# Altium project dac_brd_raton_v0.PrjPcb
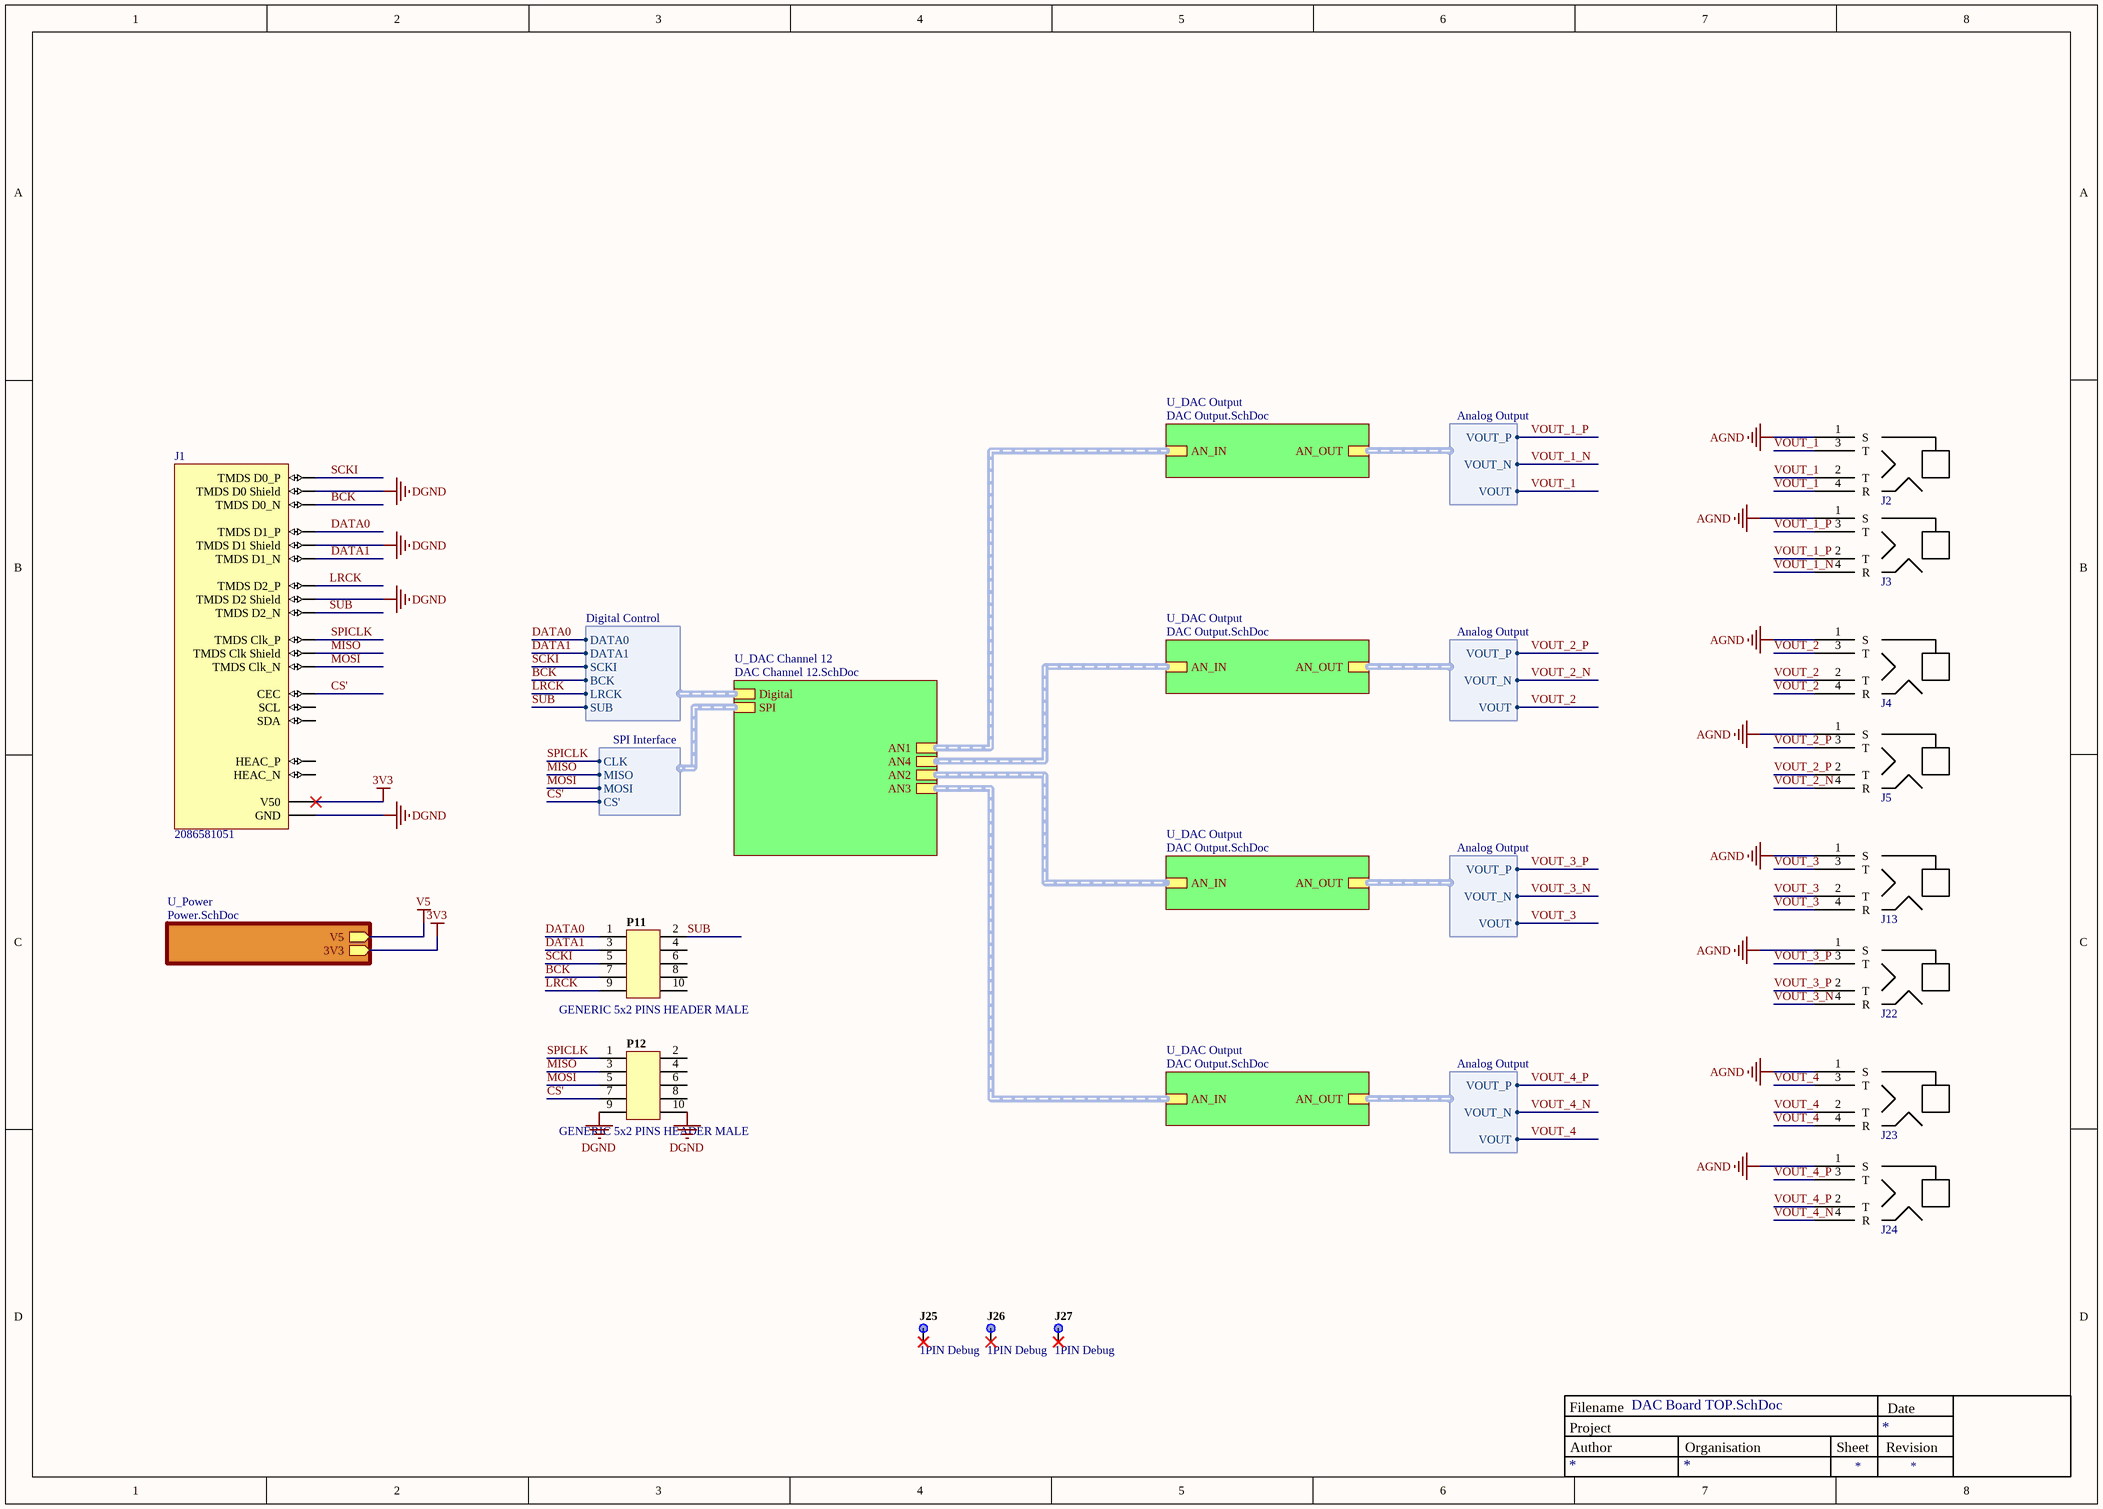
[diagram p0: DAC Board TOP.SchDoc]
4 sheets, 316 parts. Net scope: hierarchical (ports join the sheet entries above them; power ports are global).
Board file: dac_brd_raton_v0.PcbDoc
Sheets:
  DAC Board TOP.SchDoc
    U_DAC Output = DAC Output.SchDoc
    U_Power = Power.SchDoc
    U_DAC Channel 12 = DAC Channel 12.SchDoc
    U_DAC Output = DAC Output.SchDoc
    U_DAC Output = DAC Output.SchDoc
    U_DAC Output = DAC Output.SchDoc

## Sheet DAC Board TOP.SchDoc
size A3

### Parts
J1  2086581051  [2086581051]
J2  SJ1-2503A  [SJ1-2503A-Footprint-1]  (value not drawn)
J3  SJ1-2503A  [SJ1-2503A-Footprint-1]  (value not drawn)
J4  SJ1-2503A  [SJ1-2503A-Footprint-1]  (value not drawn)
J5  SJ1-2503A  [SJ1-2503A-Footprint-1]  (value not drawn)
J13  SJ1-2503A  [SJ1-2503A-Footprint-1]  (value not drawn)
J22  SJ1-2503A  [SJ1-2503A-Footprint-1]  (value not drawn)
J23  SJ1-2503A  [SJ1-2503A-Footprint-1]  (value not drawn)
J24  SJ1-2503A  [SJ1-2503A-Footprint-1]  (value not drawn)
J25  1PIN Debug  [1 Pin Debug Port 0.9mm]
J26  1PIN Debug  [1 Pin Debug Port 0.9mm]
J27  1PIN Debug  [1 Pin Debug Port 0.9mm]
P11  GENERIC 5x2 PINS HEADER MALE  [GENERIC 5PIN 2ROW HEADER 0]
P12  GENERIC 5x2 PINS HEADER MALE  [GENERIC 5PIN 2ROW HEADER 0]

### Sub-sheets
U_DAC Channel 12 = DAC Channel 12.SchDoc: SPI (harness SPI Interface), AN1 (harness Analog Input), AN4 (harness Analog Input), AN2 (harness Analog Input), AN3 (harness Analog Input), Digital (harness Digital Control)
U_DAC Output = DAC Output.SchDoc: AN_IN (harness Analog Input), AN_OUT (harness Analog Output)
U_DAC Output = DAC Output.SchDoc: AN_IN (harness Analog Input), AN_OUT (harness Analog Output)
U_DAC Output = DAC Output.SchDoc: AN_IN (harness Analog Input), AN_OUT (harness Analog Output)
U_DAC Output = DAC Output.SchDoc: AN_IN (harness Analog Input), AN_OUT (harness Analog Output)
U_Power = Power.SchDoc: V5 (out), 3V3 (out)

### Harnesses
Analog Output: VOUT_P, VOUT_N, VOUT
Digital Control: DATA0, DATA1, SCKI, BCK, LRCK, SUB
SPI Interface: CLK, MISO, MOSI, CS'

### Nets
3V3: J1.18(V50) ; sheet U_Power/3V3
AGND: J2.1(S) J3.1(S) J4.1(S) J5.1(S) J13.1(S) J22.1(S) J23.1(S) J24.1(S)
DGND: J1.2(TMDS_D2_Shield) J1.5(TMDS_D1_Shield) J1.8(TMDS_D0_Shield) J1.17(GND) P12.9 P12.10
BCK: J1.9(TMDS_D0_N) P11.7 ; sheet U_DAC Channel 12/Digital.BCK
CS': J1.13(CEC) P12.7 ; sheet U_DAC Channel 12/SPI.CS'
DATA0: J1.4(TMDS_D1_P) P11.1 ; sheet U_DAC Channel 12/Digital.DATA0
DATA1: J1.6(TMDS_D1_N) P11.3 ; sheet U_DAC Channel 12/Digital.DATA1
LRCK: J1.1(TMDS_D2_P) P11.9 ; sheet U_DAC Channel 12/Digital.LRCK
MISO: J1.11(TMDS_Clk_Shield) P12.3 ; sheet U_DAC Channel 12/SPI.MISO
MOSI: J1.12(TMDS_Clk_N) P12.5 ; sheet U_DAC Channel 12/SPI.MOSI
SCKI: J1.7(TMDS_D0_P) P11.5 ; sheet U_DAC Channel 12/Digital.SCKI
SPICLK: J1.10(TMDS_Clk_P) P12.1 ; sheet U_DAC Channel 12/SPI.CLK
SUB: J1.3(TMDS_D2_N) P11.2 ; sheet U_DAC Channel 12/Digital.SUB
VOUT_1: J2.2(T) J2.3(T) J2.4(R) ; sheet U_DAC Output/AN_OUT.VOUT  [project net VOUT]
VOUT_1_N: J3.4(R) ; sheet U_DAC Output/AN_OUT.VOUT_N
VOUT_1_P: J3.2(T) J3.3(T) ; sheet U_DAC Output/AN_OUT.VOUT_P
VOUT_2: J4.2(T) J4.3(T) J4.4(R) ; sheet U_DAC Output/AN_OUT.VOUT  [project net VOUT]
VOUT_2_N: J5.4(R) ; sheet U_DAC Output/AN_OUT.VOUT_N
VOUT_2_P: J5.2(T) J5.3(T) ; sheet U_DAC Output/AN_OUT.VOUT_P
VOUT_3: J13.2(T) J13.3(T) J13.4(R) ; sheet U_DAC Output/AN_OUT.VOUT  [project net VOUT]
VOUT_3_N: J22.4(R) ; sheet U_DAC Output/AN_OUT.VOUT_N
VOUT_3_P: J22.2(T) J22.3(T) ; sheet U_DAC Output/AN_OUT.VOUT_P
VOUT_4: J23.2(T) J23.3(T) J23.4(R) ; sheet U_DAC Output/AN_OUT.VOUT  [project net VOUT]
VOUT_4_N: J24.4(R) ; sheet U_DAC Output/AN_OUT.VOUT_N
VOUT_4_P: J24.2(T) J24.3(T) ; sheet U_DAC Output/AN_OUT.VOUT_P

Not connected (* = marked no-connect by the designer): J1 14(HEAC_P) 15(SCL) 16(SDA) 19(HEAC_N); J25 1*; J26 1*; J27 1*; P11 4 6 8 10; P12 2 4 6 8

### Buses and harness runs
harness sheet U_DAC Channel 12/AN1 = sheet U_DAC Output/AN_IN
harness sheet U_DAC Channel 12/AN2 = sheet U_DAC Output/AN_IN
harness sheet U_DAC Channel 12/AN3 = sheet U_DAC Output/AN_IN
harness sheet U_DAC Channel 12/AN4 = sheet U_DAC Output/AN_IN

### Notes on the sheet
- Project
- Filename
- Author
- Organisation
- Sheet
- Revision
- Date
  Date

### Library data of the parts
J1 = 2086581051-2: CONN FEM SMD 19 90Deg HDMI; Manufacturer: Molex; Status: Active; Supplier 1: Mouser; Source: Connector Library.SchLib; Design Item ID: 2086581051; Bin: *; Supplier Part Number 1: Mouser; Type: HYBRID; Case/Package: 4 PIN
J2-J5 J13 J22-J24 = SJ1-2503A-1: CONN JACK STEREO 2.5MM R/A; Shielding: Unshielded; Number of Ports: 1; Current Rating: 1A; Body Material: Brass; Number of Conductors: 3; Gender: Female; Connector Type: Jack; Diameter: 2.5mm; Color: Black; Packaging: Bulk; Mount: Through Hole; Lead Free: Lead Free; Orientation: Horizontal; Termination: Solder; Contact Plating: Tin
J25-J27 = 1PIN Debug-2: CONN MAL TH 1 0Deg HEADER; Status: NC; Case/Package: 1 PIN; Source: Connector Library.SchLib; Type: N/A; Design Item ID: 1PIN Debug
P11 P12 = GENERIC 5x2 PINS HEADER MALE-2: CONN MAL TH 5x2 0Deg HEADER; Bin: B3-J5; Status: Active; Case/Package: 2 PIN; Source: Connector Library.SchLib; Type: TH; Design Item ID: GENERIC 5x2 PINS HEADER MALE; Manufacturer: Generic

## Sheet DAC Output.SchDoc
size A3
Used 4 times, as channels U_DAC Output, U_DAC Output, U_DAC Output, U_DAC Output. Parts and nets are listed once, with the designators drawn on the sheet.
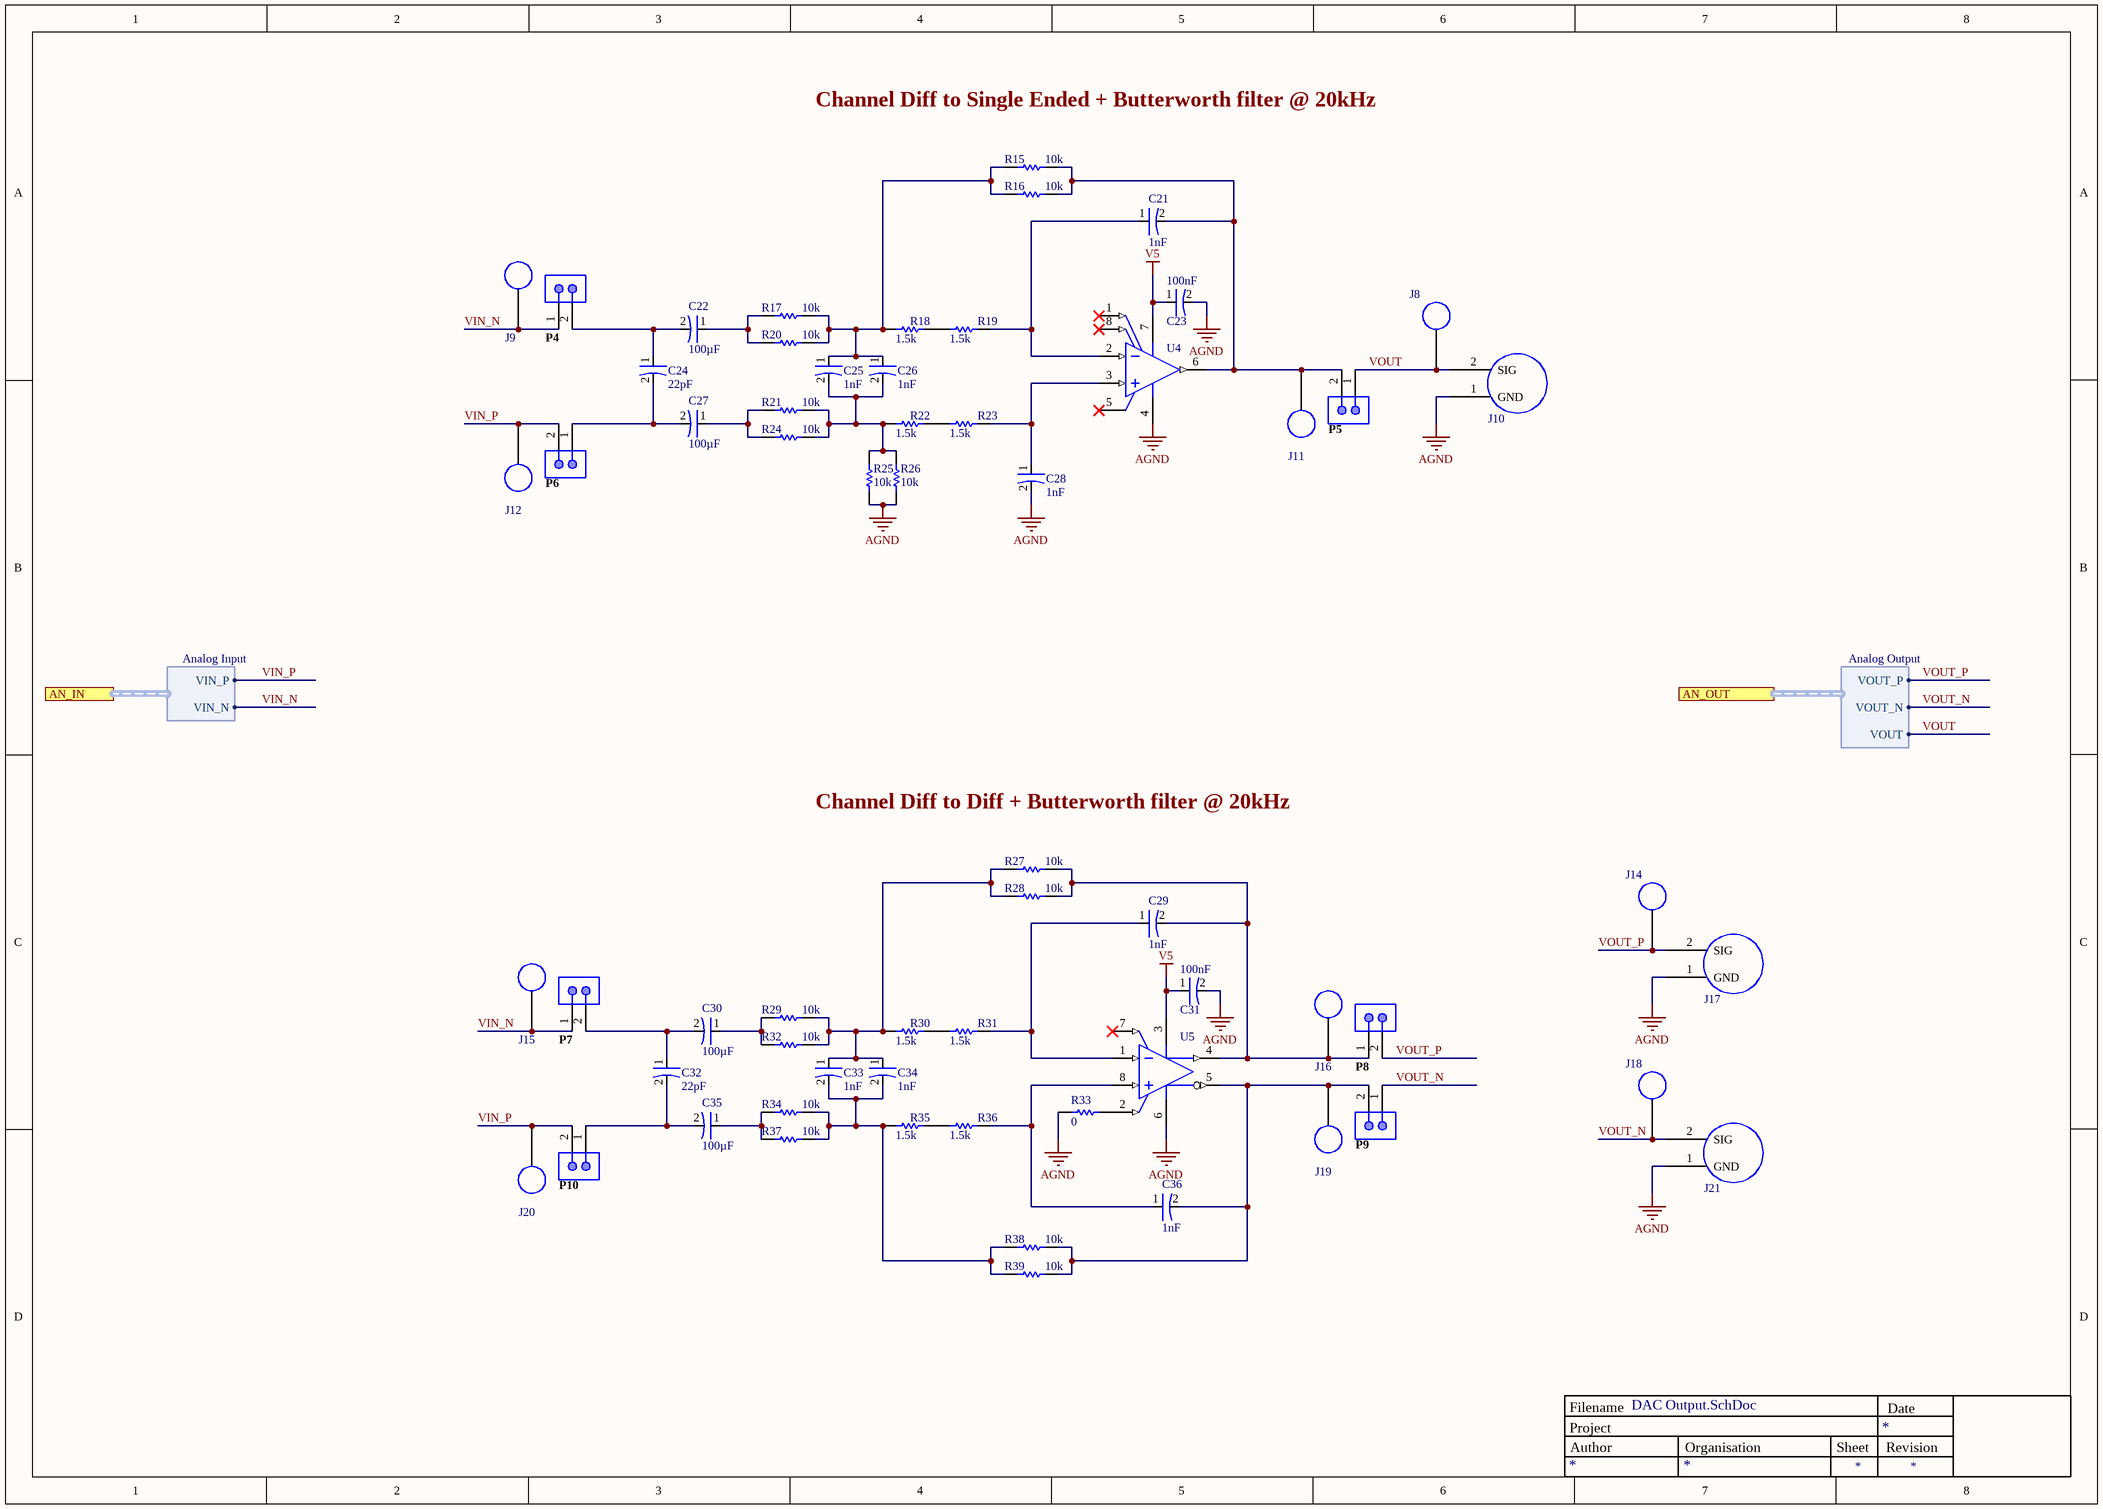
[diagram p1: DAC Output.SchDoc]

### Parts
C21  value 1nF  [0402-M]  (hidden comment: CAP 1nF CER 0402 50V X5R 10%)
C22  value 100µF  [1210-M]  (hidden comment: CAP 100uF CER 1210 16V X5R 20%)
C23  value 100nF  [0805-M]  (hidden comment: CAP 0.1uF CER 0805 50V  X7R 5%)
C24  value 22pF  [0805-M]  (hidden comment: CAP 22pF CER 0805 50V C0G 2%)
C25  value 1nF  [0402-M]  (hidden comment: CAP 1nF CER 0402 50V X5R 10%)
C26  value 1nF  [0402-M]  (hidden comment: CAP 1nF CER 0402 50V X5R 10%)
C27  value 100µF  [1210-M]  (hidden comment: CAP 100uF CER 1210 16V X5R 20%)
C28  value 1nF  [0402-M]  (hidden comment: CAP 1nF CER 0402 50V X5R 10%)
C29  value 1nF  [0402-M]  (hidden comment: CAP 1nF CER 0402 50V X5R 10%)
C30  value 100µF  [1210-M]  (hidden comment: CAP 100uF CER 1210 16V X5R 20%)
C31  value 100nF  [0805-M]  (hidden comment: CAP 0.1uF CER 0805 50V  X7R 5%)
C32  value 22pF  [0805-M]  (hidden comment: CAP 22pF CER 0805 50V C0G 2%)
C33  value 1nF  [0402-M]  (hidden comment: CAP 1nF CER 0402 50V X5R 10%)
C34  value 1nF  [0402-M]  (hidden comment: CAP 1nF CER 0402 50V X5R 10%)
C35  value 100µF  [1210-M]  (hidden comment: CAP 100uF CER 1210 16V X5R 20%)
C36  value 1nF  [0402-M]  (hidden comment: CAP 1nF CER 0402 50V X5R 10%)
J8  151-203-RC  [151-203-RC-Footprint-1]  (value not drawn)
J9  151-203-RC  [151-203-RC-Footprint-1]  (value not drawn)
J10  SMA CONNECTOR  [SMA CONNECTOR-Footprint-1]  (value not drawn)
J11  151-203-RC  [151-203-RC-Footprint-1]  (value not drawn)
J12  151-203-RC  [151-203-RC-Footprint-1]  (value not drawn)
J14  151-203-RC  [151-203-RC-Footprint-1]  (value not drawn)
J15  151-203-RC  [151-203-RC-Footprint-1]  (value not drawn)
J16  151-203-RC  [151-203-RC-Footprint-1]  (value not drawn)
J17  SMA CONNECTOR  [SMA CONNECTOR-Footprint-1]  (value not drawn)
J18  151-203-RC  [151-203-RC-Footprint-1]  (value not drawn)
J19  151-203-RC  [151-203-RC-Footprint-1]  (value not drawn)
J20  151-203-RC  [151-203-RC-Footprint-1]  (value not drawn)
J21  SMA CONNECTOR  [SMA CONNECTOR-Footprint-1]  (value not drawn)
P4  GENERIC 2PIN HEADER MALE  [GENERIC 2PIN HEADER 0]  (value not drawn)
P5  GENERIC 2PIN HEADER MALE  [GENERIC 2PIN HEADER 0]  (value not drawn)
P6  GENERIC 2PIN HEADER MALE  [GENERIC 2PIN HEADER 0]  (value not drawn)
P7  GENERIC 2PIN HEADER MALE  [GENERIC 2PIN HEADER 0]  (value not drawn)
P8  GENERIC 2PIN HEADER MALE  [GENERIC 2PIN HEADER 0]  (value not drawn)
P9  GENERIC 2PIN HEADER MALE  [GENERIC 2PIN HEADER 0]  (value not drawn)
P10  GENERIC 2PIN HEADER MALE  [GENERIC 2PIN HEADER 0]  (value not drawn)
R15  value 10k  [0805-M]  (hidden comment: RES 10k 0805 125mW 1%)
R16  value 10k  [0805-M]  (hidden comment: RES 10k 0805 125mW 1%)
R17  value 10k  [0805-M]  (hidden comment: RES 10k 0805 125mW 1%)
R18  value 1.5k  [0402-M]  (hidden comment: RES 1.5k 0402 63mW 5%)
R19  value 1.5k  [0402-M]  (hidden comment: RES 1.5k 0402 63mW 5%)
R20  value 10k  [0805-M]  (hidden comment: RES 10k 0805 125mW 1%)
R21  value 10k  [0805-M]  (hidden comment: RES 10k 0805 125mW 1%)
R22  value 1.5k  [0402-M]  (hidden comment: RES 1.5k 0402 63mW 5%)
R23  value 1.5k  [0402-M]  (hidden comment: RES 1.5k 0402 63mW 5%)
R24  value 10k  [0805-M]  (hidden comment: RES 10k 0805 125mW 1%)
R25  value 10k  [0805-M]  (hidden comment: RES 10k 0805 125mW 1%)
R26  value 10k  [0805-M]  (hidden comment: RES 10k 0805 125mW 1%)
R27  value 10k  [0805-M]  (hidden comment: RES 10k 0805 125mW 1%)
R28  value 10k  [0805-M]  (hidden comment: RES 10k 0805 125mW 1%)
R29  value 10k  [0805-M]  (hidden comment: RES 10k 0805 125mW 1%)
R30  value 1.5k  [0402-M]  (hidden comment: RES 1.5k 0402 63mW 5%)
R31  value 1.5k  [0402-M]  (hidden comment: RES 1.5k 0402 63mW 5%)
R32  value 10k  [0805-M]  (hidden comment: RES 10k 0805 125mW 1%)
R33  value 0  [0402-M]  (hidden comment: RES 0 0402 63mW)
R34  value 10k  [0805-M]  (hidden comment: RES 10k 0805 125mW 1%)
R35  value 1.5k  [0402-M]  (hidden comment: RES 1.5k 0402 63mW 5%)
R36  value 1.5k  [0402-M]  (hidden comment: RES 1.5k 0402 63mW 5%)
R37  value 10k  [0805-M]  (hidden comment: RES 10k 0805 125mW 1%)
R38  value 10k  [0805-M]  (hidden comment: RES 10k 0805 125mW 1%)
R39  value 10k  [0805-M]  (hidden comment: RES 10k 0805 125mW 1%)
U4  OPA227UA/2K5  [D0008A_L]  (value not drawn)
U5  OPA1632DR  [D0008A_L]  (value not drawn)

### Ports
AN_IN (harness Analog Input), AN_OUT (harness Analog Output)

### Harnesses
Analog Input: VIN_P, VIN_N
Analog Output: VOUT_P, VOUT_N, VOUT

### Nets
AGND: C23.2(Cathode) C28.2(Cathode) C31.2(Cathode) J10.1(GND) J17.1(GND) J21.1(GND) R25.1 R26.1 R33.1 U4.4(V-) U5.6(V-)
V5: C23.1(Anode) C31.1(Anode) U4.7(V+) U5.3(V+)
VIN_N: J9.1 J15.1 P4.1 P7.1 ; port AN_IN.VIN_N
VIN_P: J12.1 J20.1 P6.2 P10.2 ; port AN_IN.VIN_P
VOUT: J8.1 J10.2(SIG) P5.1 ; port AN_OUT.VOUT
VOUT_N: J18.1 J21.2(SIG) P9.1 ; port AN_OUT.VOUT_N
VOUT_P: J14.1 J17.2(SIG) P8.2 ; port AN_OUT.VOUT_P
NetC21_1: C21.1(Anode) R19.2 U4.2(IN-)
NetC21_2: C21.2(Cathode) J11.1 P5.2 R15.2 R16.2 U4.6(OUT)
NetC22_1: C22.1(Anode) R17.1 R20.1
NetC22_2: C22.2(Cathode) C24.1(Anode) P4.2
NetC24_2: C24.2(Cathode) C27.2(Cathode) P6.1
NetC25_1: C25.1(Anode) C26.1(Anode) R15.1 R16.1 R17.2 R18.1 R20.2
NetC25_2: C25.2(Cathode) C26.2(Cathode) R21.2 R22.1 R24.2 R25.2 R26.2
NetC27_1: C27.1(Anode) R21.1 R24.1
NetC28_1: C28.1(Anode) R23.2 U4.3(IN+)
NetC29_1: C29.1(Anode) R31.2 U5.1(VIN-)
NetC29_2: C29.2(Cathode) J16.1 P8.1 R27.2 R28.2 U5.4(VOUT+)
NetC30_1: C30.1(Anode) R29.1 R32.1
NetC30_2: C30.2(Cathode) C32.1(Anode) P7.2
NetC32_2: C32.2(Cathode) C35.2(Cathode) P10.1
NetC33_1: C33.1(Anode) C34.1(Anode) R27.1 R28.1 R29.2 R30.1 R32.2
NetC33_2: C33.2(Cathode) C34.2(Cathode) R34.2 R35.1 R37.2 R38.2 R39.2
NetC35_1: C35.1(Anode) R34.1 R37.1
NetC36_1: C36.1(Anode) R36.2 U5.8(VIN+)
NetC36_2: C36.2(Cathode) J19.1 P9.2 R38.1 R39.1 U5.5(VOUT-)
NetR18_2: R18.2 R19.1
NetR22_2: R22.2 R23.1
NetR30_2: R30.2 R31.1
NetR33_2: R33.2 U5.2(VOCM)
NetR35_2: R35.2 R36.1

Not connected (* = marked no-connect by the designer): U4 1(TRIM)* 5(NC)* 8(TRIM)*; U5 7(ENABLE)*

### Channels
U_DAC Output: designators end in _1
U_DAC Output: designators end in _2
U_DAC Output: designators end in _3
U_DAC Output: designators end in _4

### Notes on the sheet
- Channel Diff to Single Ended + Butterworth filter @ 20kHz
- Channel Diff to Diff + Butterworth filter @ 20kHz
- Project
- Filename
- Author
- Organisation
- Sheet
- Revision
- Date
  Date

### Library data of the parts
C21 C25 C26 C28 C29 C33 C34 C36 = CAP 1nF CER 0402 50V X5R 10%-2: CAP-1nF-CER-0402-50V-X5R-10%; Manufacturer: Generic; Bin: N; Type: SMD; Status: Active; Source: Capacitor Library.SchLib; Supplier 1: Mouser; Case/Package: 0402; Supplier Part Number 1: 81-GRM155R61H102KA1D; Design Item ID: CAP 1nF CER 0402 50V X5R 10%
C22 C27 C30 C35 = CAP 100uF CER 1210 16V X5R 20%-2: CAP-100uF-CER-1210-16V-X5R-20%; Manufacturer: Generic; Bin: F1-C5-1 / F1-C2-8; Type: SMD; Case/Package: 1210; Supplier 1: Digi-Key; Source: Capacitor Library.SchLib; Design Item ID: CAP 100uF CER 1210 16V X5R 20%; Status: Active; Supplier Part Number 1: 587-3152-6-ND
C23 C31 = CAP 0.1uF CER 0805 50V  X7R 5%-2: CAP-0.1uF-CER-0805-50V- X7R-5%; Manufacturer: Generic; Bin: F1-C6-4; Type: SMD; Design Item ID: CAP 0.1uF CER 0805 50V  X7R 5%; Supplier 1: Mouser; Datasheet: http://www.kemet.com/Lists/ProductCatalog/Attachments/53/KEM_C1002_X7R_SMD.pdf; Source: Capacitor Library.SchLib; Case/Package: 0805; Status: Active; Supplier Part Number 1: 80-C0805C104J3R
C24 C32 = CAP 22pF CER 0805 50V C0G 2%-2: Manufacturer: Generic; Type: SMD; Supplier 1: Mouser; Design Item ID: CAP 22pF CER 0805 50V C0G 2%; Source: Capacitor Library.SchLib; Supplier Part Number 1: 77-VJ0805A220GXACBC; Case/Package: 0805
J8 J9 J11 J12 J14-J16 J18-J20 = CMP-002-00000-2: PCB-Probe-Ring; Color: Black
J10 J17 J21 = CMP-002-00001-2: Manufacturer: LPRS; Connector Type: SMA,Coaxial; Max Frequency: 6GHz; Impedance: 50R; Supplier No: 471-SMACONNECTOR; Contact Material: Gold; Supplier: Mouser; REACH SVHC: No SVHC; Case/Package: SMA; Contact Plating: Gold
P4-P10 = GENERIC 2PIN HEADER MALE-2: CONN MAL TH 2 0Deg HEADER; Bin: B3-J5; Manufacturer: Generic; Design Item ID: GENERIC 2PIN HEADER MALE; Type: TH; Status: Active; Source: Connector Library.SchLib; Case/Package: n/a PIN
R15-R17 R20 R21 R24-R29 R32 R34 R37-R39 = RES 10k 0805 125mW 1%-1: RES-10k-0805-125mW-1%; Manufacturer: Generic; MAPPING: 1(2,1,10k); Bin: F1-R12-10; Design Item ID: RES 10k 0805 125mW 1%; Case/Package: 0805; Type: SMD; Status: Active; Source: Resistor Library.SchLib
R18 R19 R22 R23 R30 R31 R35 R36 = RES 1.5k 0402 63mW 5%-1: RES-1.5k-0402-63mW-5%; Manufacturer: Generic; MAPPING: 1(2,1,11.5k); Bin: F1-RM1-1; Case/Package: 0402; Source: Resistor Library.SchLib; Type: SMD; Status: Active; Design Item ID: RES 1.5k 0402 63mW 5%
R33 = RES 0 0402 63mW-1: RES-0-0402-63mW-5%; Manufacturer: Generic; MAPPING: 1(2,1,11.5k); Bin: F1-RM1-5; Source: Resistor Library.SchLib; Design Item ID: RES 0 0402 63mW; Case/Package: 0402; Type: SMD; Status: Active
U4 = CMP-019-00001-1: IC OPAMP GP 8MHZ 8SOIC; Slew Rate: 2.3V/µs; Input Bias Current: 10nA; Max Supply Voltage: 18V; Input Offset Voltage (Vos): 200uV; Operating Supply Current: 3.7mA; Number of Circuits: 1; Output Current per Channel: 45mA; Nominal Supply Current: 3.8mA; Common Mode Rejection Ratio: 120dB; Voltage Gain: 160dB; Power Supply Rejection Ratio (PSRR): 126.02dB; Min Dual Supply Voltage: 2.5V; Number of Pins: 8; Radiation Hardening: No; Max Dual Supply Voltage: 18V; Packaging: Tape and Reel; Max I/O Voltage: 200uV; Contact Plating: Gold; Number of Channels: 1; Case/Package: D; Gain Bandwidth Product: 8MHz; Min Operating Temperature: -40°C; Nominal Gain Bandwidth Product: 8MHz; Max Operating Temperature: 85°C; Unity Gain Bandwidth Product: 8MHz; Output Current: 45mA; Bandwidth: 8MHz; Package Quantity: 2500; Number of Elements: 1; Lead Free: Lead Free
U5 = CMP-019-00002-1: IC OPAMP AUDIO 180MHZ 8SOIC; Operating Supply Current: 14mA; Min Supply Voltage: 5V; Voltage Gain: 78dB; Max Supply Voltage: 32V; Max Dual Supply Voltage: 16V; Number of Circuits: 1; Output Current: 85mA; Power Supply Rejection Ratio (PSRR): 70dB; Input Offset Voltage (Vos): 3mV; Min Dual Supply Voltage: 2.5V; Common Mode Rejection Ratio: 74dB; Slew Rate: 50V/µs; Dual Supply Voltage: 15V; Max Power Dissipation: 2W; Input Bias Current: 2uA; Supply Type: Single,Dual; Gain Bandwidth Product: 180MHz; Package Quantity: 2500; Case/Package: D; Bandwidth: 180MHz; Nominal Gain Bandwidth Product: 180MHz; -3db Bandwidth: 180MHz; Number of Pins: 8; Number of Elements: 1; Output Current per Channel: 85mA; Radiation Hardening: No; Number of Channels: 1; Nominal Supply Current: 14mA; Gain: 78dB; Max Operating Temperature: 85°C; Weight: 0.002677oz; Packaging: Tape and Reel; Min Operating Temperature: -40°C; Lead Free: Lead Free; Contact Plating: Gold

## Sheet Power.SchDoc
size A3
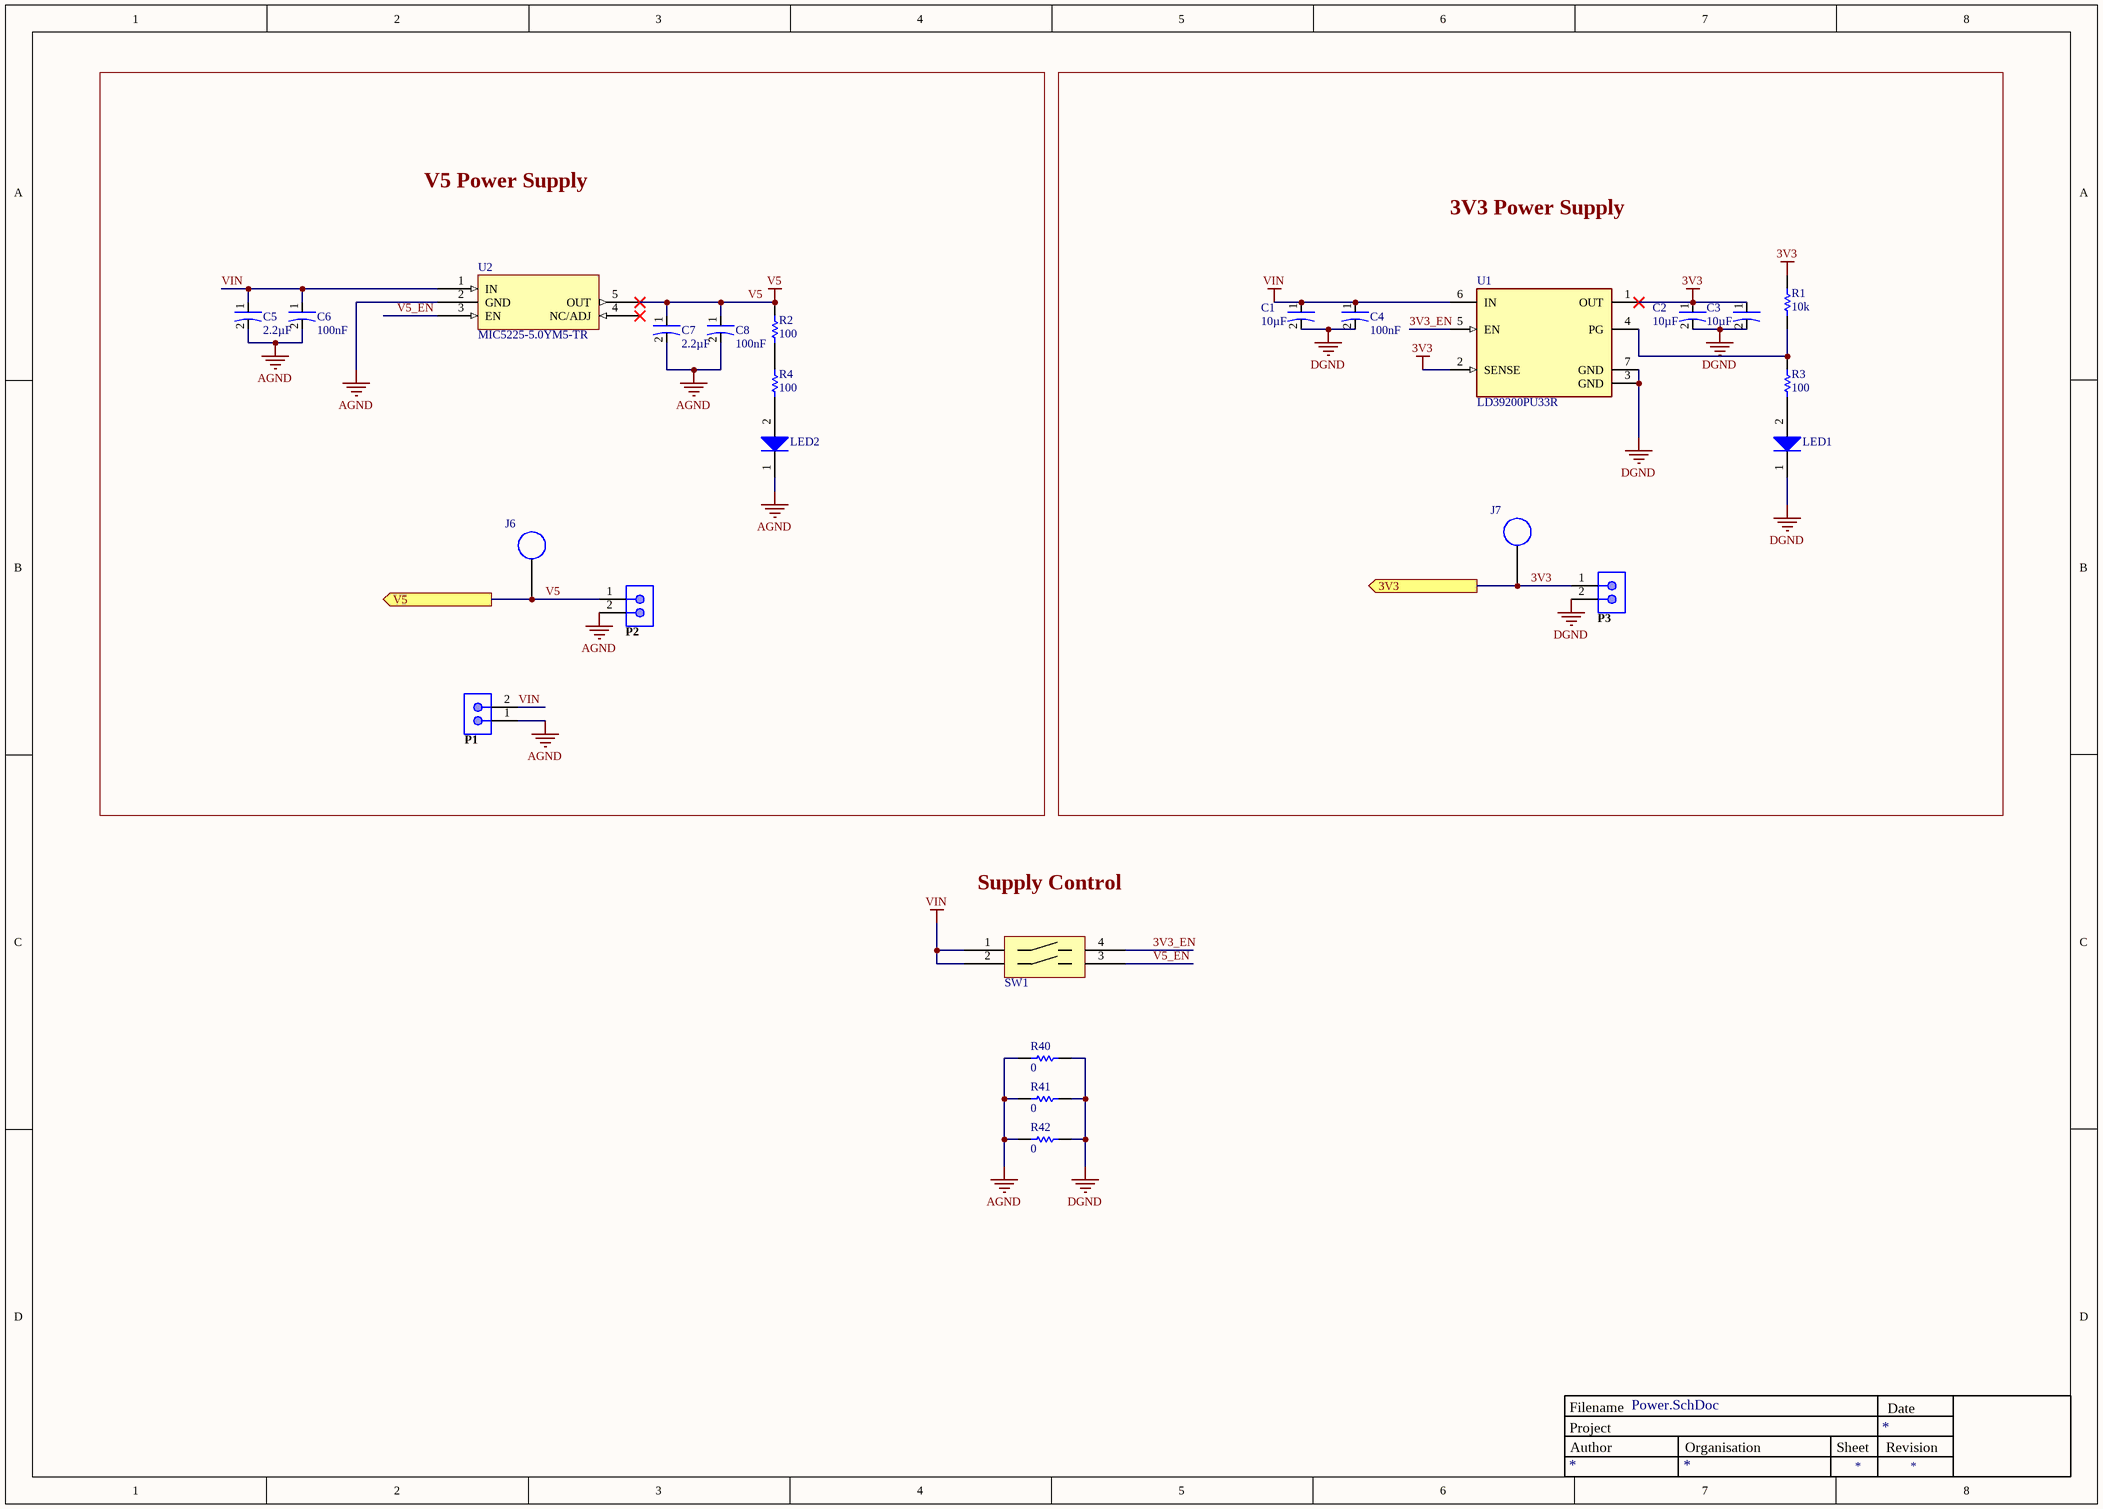
[diagram p2: Power.SchDoc]

### Parts
C1  value 10µF  [0402-M]  (hidden comment: CAP 10uF CER 0402 6.3V X5R 20%)
C2  value 10µF  [0402-M]  (hidden comment: CAP 10uF CER 0402 6.3V X5R 20%)
C3  value 10µF  [0402-M]  (hidden comment: CAP 10uF CER 0402 6.3V X5R 20%)
C4  value 100nF  [0402-M]  (hidden comment: CAP 0.1uF CER 0402 16V X5R 10%)
C5  value 2.2µF  [0402-M]  (hidden comment: CAP 2.2uF CER 0402 25V X5R 10%)
C6  value 100nF  [0402-M]  (hidden comment: CAP 0.1uF CER 0402 16V X5R 10%)
C7  value 2.2µF  [0402-M]  (hidden comment: CAP 2.2uF CER 0402 25V X5R 10%)
C8  value 100nF  [0402-M]  (hidden comment: CAP 0.1uF CER 0402 16V X5R 10%)
J6  151-203-RC  [151-203-RC-Footprint-1]  (value not drawn)
J7  151-203-RC  [151-203-RC-Footprint-1]  (value not drawn)
LED1  LED 0603 Green 20mA 1.8V  [0603 Generic]  (value not drawn)
LED2  LED 0603 Green 20mA 1.8V  [0603 Generic]  (value not drawn)
P1  GENERIC 2PIN HEADER MALE  [GENERIC 2PIN HEADER 0]  (value not drawn)
P2  GENERIC 2PIN HEADER MALE  [GENERIC 2PIN HEADER 0]  (value not drawn)
P3  GENERIC 2PIN HEADER MALE  [GENERIC 2PIN HEADER 0]  (value not drawn)
R1  value 10k  [0402-M]  (hidden comment: RES 10k 0402 63mW 5%)
R2  value 100  [0805-L]  (hidden comment: RES 100 0805 125mW 1%)
R3  value 100  [0805-L]  (hidden comment: RES 100 0805 125mW 1%)
R4  value 100  [0805-L]  (hidden comment: RES 100 0805 125mW 1%)
R40  value 0  [0402-M]  (hidden comment: RES 0 0402 63mW)
R41  value 0  [0402-M]  (hidden comment: RES 0 0402 63mW)
R42  value 0  [0402-M]  (hidden comment: RES 0 0402 63mW)
SW1  210-2MS  [210-2MS-Footprint-1]  (value not drawn)
U1  LD39200PU33R  [FP-DFN6-7946637-MFG]
U2  MIC5225-5.0YM5-TR  [SOT95P280X145-5N]

### Blocks framed on the sheet
V5 Power Supply: C5-C8 J6 LED2 P1 P2 R2 R4 U2
3V3 Power Supply: C1-C4 J7 LED1 P3 R1 R3 U1

### Ports
3V3 (out), V5 (out)

### Nets
3V3: C2.1(Anode) C3.1(Anode) J7.1 P3.1 R1.2 U1.1(OUT) U1.2(SENSE) ; port 3V3
AGND: C5.2(Cathode) C6.2(Cathode) C7.2(Cathode) C8.2(Cathode) LED2.1 P1.1 P2.2 R40.1 R41.1 R42.1 U2.2(GND)
DGND: C1.2(Cathode) C2.2(Cathode) C3.2(Cathode) C4.2(Cathode) LED1.1 P3.2 R40.2 R41.2 R42.2 U1.3(GND) U1.7(GND)
V5: C7.1(Anode) C8.1(Anode) J6.1 P2.1 R2.2 U2.5(OUT) ; port V5
VIN: C1.1(Anode) C4.1(Anode) C5.1(Anode) C6.1(Anode) P1.2 SW1.1 SW1.2 U1.6(IN) U2.1(IN)
3V3_EN: SW1.4 U1.5(EN)
V5_EN: SW1.3 U2.3(EN)
NetLED1_2: LED1.2 R3.1
NetLED2_2: LED2.2 R4.1
NetR1_1: R1.1 R3.2 U1.4(PG)
NetR2_1: R2.1 R4.2

Not connected (* = marked no-connect by the designer): U2 4(NC/ADJ)*

### Notes on the sheet
- Supply Control
- Project
- Filename
- Author
- Organisation
- Sheet
- Revision
- Date
  Date

### Library data of the parts
C1-C3 = CAP 10uF CER 0402 6.3V X5R 20%-2: CAP-10uF-CER-0402-6.3V-X5R-20%; Manufacturer: Generic; Type: SMD; Bin: F1-C2-10; Supplier Part Number 1: 80-C0402C106M9P; Source: Capacitor Library.SchLib; Case/Package: 0402; Supplier 1: Mouser; Design Item ID: CAP 10uF CER 0402 6.3V X5R 20%
C4 C6 C8 = CAP 0.1uF CER 0402 16V X5R 10%-2: CAP-0.1uF-CER-0402-16V-X5R-10%; Manufacturer: Generic; Bin: CAP1-M1; Type: SMD; Source: Capacitor Library.SchLib; Status: Active; Design Item ID: CAP 0.1uF CER 0402 16V X5R 10%; Supplier 1: Mouser; Supplier Part Number 1: 810-CGA2B2X5R1C104KA; Case/Package: 0402
C5 C7 = CAP 2.2uF CER 0402 25V X5R 10%-2: CAP-2.2uF-CER-0402-25V-X5R-10%; Manufacturer: Generic; Bin: F1-C1-9; Type: SMD; Supplier Part Number 1: 810-C1005X5R1E225K; Status: Active; Supplier 1: Mouser; Source: Capacitor Library.SchLib; Design Item ID: CAP 2.2uF CER 0402 25V X5R 10%; Case/Package: 0402
J6 J7 = CMP-002-00000-2: PCB-Probe-Ring; Color: Black
LED1 LED2 = LED 0603 Green 20mA 1.8V-1: LED-0603-Green-20mA-1.8V-STOCK; Manufacturer: Generic; Bin: F2-DM1-1; Type: SMD; Design Item ID: LED 0603 Green 20mA 1.8V; Status: Active; Supplier 1: Mouser; Supplier Part Number 1: 645-598-8060-107F; Case/Package: 0603; Source: Diode Library.SchLib
P1-P3 = GENERIC 2PIN HEADER MALE-2: CONN MAL TH 2 0Deg HEADER; Bin: B3-J5; Manufacturer: Generic; Design Item ID: GENERIC 2PIN HEADER MALE; Type: TH; Status: Active; Source: Connector Library.SchLib; Case/Package: n/a PIN
R1 = RES 10k 0402 63mW 5%-1: RES-10k-0402-63mW-5%; Manufacturer: Generic; Bin: F1-R7-9; MAPPING: 1(2,1,11.5k); Design Item ID: RES 10k 0402 63mW 5%; Type: SMD; Status: Active; Case/Package: 0402; Source: Resistor Library.SchLib
R2-R4 = RES 100 0805 125mW 1%-1: RES-100-0805-125mW-1%; Manufacturer: Generic; Bin: F1-R11-6; MAPPING: 1(2,1,10k); Status: Active; Case/Package: 0805; Source: Resistor Library.SchLib; Type: SMD; Design Item ID: RES 100 0805 125mW 1%
R40-R42 = RES 0 0402 63mW-1: as R33 on sheet DAC Output; Source: Resistor Library.SchLib; Design Item ID: RES 0 0402 63mW; Case/Package: 0402; Type: SMD; Status: Active
SW1 = CMP-01293-3: SWITCH DIP SPST 2 100mA 50V; Actuator Type: Slide (Standard); Electrical Life: 1000Cycles; Number of Positions: 2; Washable: No; Pitch: 0.1inch; Voltage Rating (DC): 20V; Terminal Pitch: 2.54mm; Contact Material: Copper; Length: 0.258inch; Termination: PC Pin; Lead Free: Lead Free; Max Current Rating: 100mA; Throw Configuration: SPST; Packaging: Rail/Tube; Current Rating: 100mA; Orientation: Straight; Min Operating Temperature: -40°C; Contact Plating: Gold,Tin; Max Operating Temperature: 85°C; Package Quantity: 85; Mount: Through Hole
U1 = CMP-01296-3: STMICROELECTRONICS - LD39200PU33R - LDO, FIXED, 3.3V, 2A, -40 TO 125DEG C; Bin: NR; Case/Package: 6-pin DFN; Manufacturer: STMicroelectronics; Status: NR; Supplier1: NR; Supplier Part Number1: NR; Type: SMD
U2 = CMP-01298-1: MICROCHIP - MIC5225-5.0YM5-TR - Fixed LDO Voltage Regulator, 2.3V to 16V, 310mV Dropout, 5Vout, 150mAout, SOT-23-5; Output Current: 150mA; Number of Regulators: 1; Output Voltage: 5V; Min Input Voltage: 2.3V; Mount: Surface Mount; Min Operating Temperature: -40°C; Max Operating Temperature: 125°C; Number of Pins: 5; Lead Free: Lead Free; Dropout Voltage: 310mV; Max Input Voltage: 16V; REACH SVHC: No SVHC; Case/Package: SOT-23-5; Packaging: Cut Tape; Output Type: Fixed; Nominal Output Voltage: 5V

## Sheet DAC Channel 12.SchDoc
size A3
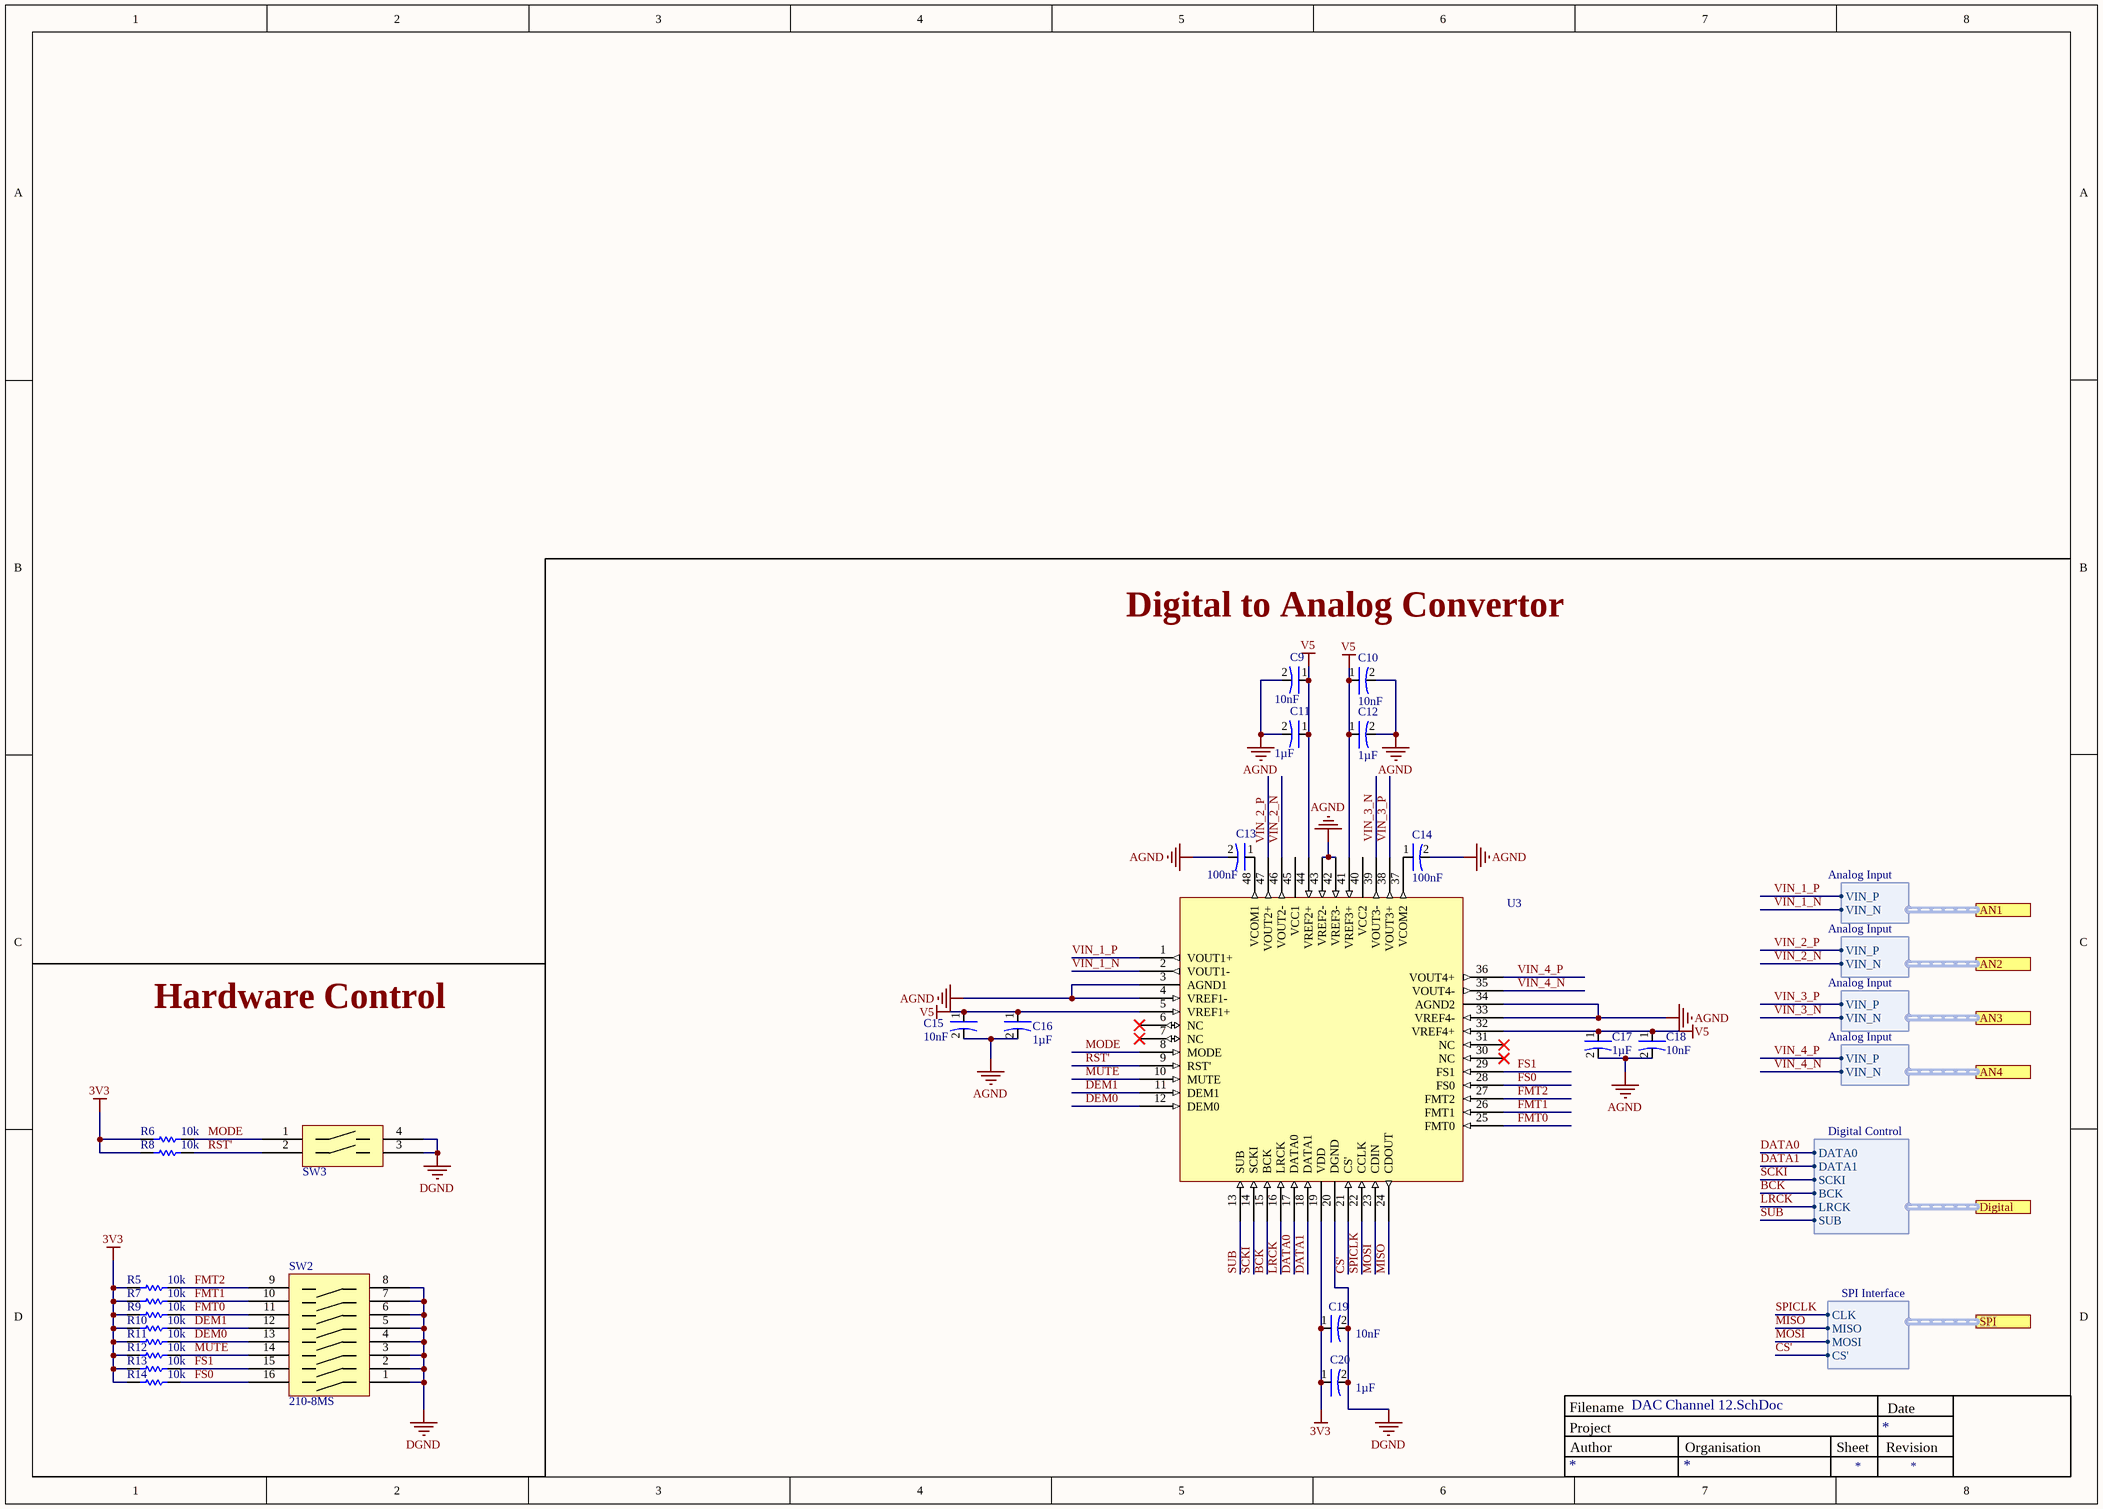
[diagram p3: DAC Channel 12.SchDoc]

### Parts
C9  value 10nF  [0805-M]  (hidden comment: CAP 10nF CER 0805 50V X7R 10%)
C10  value 10nF  [0805-M]  (hidden comment: CAP 10nF CER 0805 50V X7R 10%)
C11  value 1µF  [0805-L]  (hidden comment: CAP 1uF CER 0805 50V X7R 10%)
C12  value 1µF  [0805-L]  (hidden comment: CAP 1uF CER 0805 50V X7R 10%)
C13  value 100nF  [0603-M]  (hidden comment: CAP 100nF CER 0603 50V X7R 5%)
C14  value 100nF  [0603-M]  (hidden comment: CAP 100nF CER 0603 50V X7R 5%)
C15  value 10nF  [0805-M]  (hidden comment: CAP 10nF CER 0805 50V X7R 10%)
C16  value 1µF  [0805-L]  (hidden comment: CAP 1uF CER 0805 50V X7R 10%)
C17  value 1µF  [0805-L]  (hidden comment: CAP 1uF CER 0805 50V X7R 10%)
C18  value 10nF  [0805-M]  (hidden comment: CAP 10nF CER 0805 50V X7R 10%)
C19  value 10nF  [0805-M]  (hidden comment: CAP 10nF CER 0805 50V X7R 10%)
C20  value 1µF  [0805-L]  (hidden comment: CAP 1uF CER 0805 50V X7R 10%)
R5  value 10k  [0805-M]  (hidden comment: RES 10k 0805 125mW 1%)
R6  value 10k  [0805-M]  (hidden comment: RES 10k 0805 125mW 1%)
R7  value 10k  [0805-M]  (hidden comment: RES 10k 0805 125mW 1%)
R8  value 10k  [0805-M]  (hidden comment: RES 10k 0805 125mW 1%)
R9  value 10k  [0805-M]  (hidden comment: RES 10k 0805 125mW 1%)
R10  value 10k  [0805-M]  (hidden comment: RES 10k 0805 125mW 1%)
R11  value 10k  [0805-M]  (hidden comment: RES 10k 0805 125mW 1%)
R12  value 10k  [0805-M]  (hidden comment: RES 10k 0805 125mW 1%)
R13  value 10k  [0805-M]  (hidden comment: RES 10k 0805 125mW 1%)
R14  value 10k  [0805-M]  (hidden comment: RES 10k 0805 125mW 1%)
SW2  210-8MS  [210-8MS]
SW3  210-2MS  [210-2MS-Footprint-1]  (value not drawn)
U3  PCM4104PFBR  [CQFP50P1170X1170X100-48N]  (value not drawn)

### Ports
AN1 (harness Analog Input), AN2 (harness Analog Input), AN3 (harness Analog Input), AN4 (harness Analog Input), Digital (harness Digital Control), SPI (harness SPI Interface)

### Harnesses
SPI Interface: CLK, MISO, MOSI, CS'
Analog Input: VIN_P, VIN_N
Digital Control: DATA0, DATA1, SCKI, BCK, LRCK, SUB

### Nets
3V3: C19.1(Anode) C20.1(Anode) R5.2 R6.2 R7.2 R8.2 R9.2 R10.2 R11.2 R12.2 R13.2 R14.2 U3.19(VDD)
AGND: C9.2(Cathode) C10.2(Cathode) C11.2(Cathode) C12.2(Cathode) C13.2(Cathode) C14.2(Cathode) C15.2(Cathode) C16.2(Cathode) C17.2(Cathode) C18.2(Cathode) U3.3(AGND1) U3.4(VREF1-) U3.33(VREF4-) U3.34(AGND2) U3.42(VREF3-) U3.43(VREF2-)
DGND: C19.2(Cathode) C20.2(Cathode) SW2.1(SW1) SW2.2(SW2) SW2.3(SW3) SW2.4(SW4) SW2.5(SW1) SW2.6(SW2) SW2.7 SW2.8(SW4) SW3.3 SW3.4 U3.20(DGND)
V5: C9.1(Anode) C10.1(Anode) C11.1(Anode) C12.1(Anode) C15.1(Anode) C16.1(Anode) C17.1(Anode) C18.1(Anode) U3.5(VREF1+) U3.32(VREF4+) U3.41(VREF3+) U3.44(VREF2+)
BCK: U3.15(BCK) ; port Digital.BCK
CS': U3.21(CS') ; port SPI.CS'
DATA0: U3.17(DATA0) ; port Digital.DATA0
DATA1: U3.18(DATA1) ; port Digital.DATA1
DEM0: R11.1 SW2.13(SW4.in) U3.12(DEM0)
DEM1: R10.1 SW2.12(SW1.in) U3.11(DEM1)
FMT0: R9.1 SW2.11(SW2.in) U3.25(FMT0)
FMT1: R7.1 SW2.10(SW3.in) U3.26(FMT1)
FMT2: R5.1 SW2.9(SW4.in) U3.27(FMT2)
FS0: R14.1 SW2.16(SW1) U3.28(FS0)
FS1: R13.1 SW2.15(SW2.in) U3.29(FS1)
LRCK: U3.16(LRCK) ; port Digital.LRCK
MISO: U3.24(CDOUT) ; port SPI.MISO
MODE: R6.1 SW3.1 U3.8(MODE)
MOSI: U3.23(CDIN) ; port SPI.MOSI
MUTE: R12.1 SW2.14(SW3.in) U3.10(MUTE)
RST': R8.1 SW3.2 U3.9(RST')
SCKI: U3.14(SCKI) ; port Digital.SCKI
SPICLK: U3.22(CCLK) ; port SPI.CLK
SUB: U3.13(SUB) ; port Digital.SUB
VIN_1_N: U3.2(VOUT1-) ; port AN1.VIN_N
VIN_1_P: U3.1(VOUT1+) ; port AN1.VIN_P
VIN_2_N: U3.46(VOUT2-) ; port AN2.VIN_N
VIN_2_P: U3.47(VOUT2+) ; port AN2.VIN_P
VIN_3_N: U3.39(VOUT3-) ; port AN3.VIN_N
VIN_3_P: U3.38(VOUT3+) ; port AN3.VIN_P
VIN_4_N: U3.35(VOUT4-) ; port AN4.VIN_N
VIN_4_P: U3.36(VOUT4+) ; port AN4.VIN_P
NetC13_1: C13.1(Anode) U3.48(VCOM1)
NetC14_1: C14.1(Anode) U3.37(VCOM2)

Not connected (* = marked no-connect by the designer): U3 6(NC)* 7(NC)* 30(NC)* 31(NC)* 40(VCC2) 45(VCC1)

### Notes on the sheet
- Digital to Analog Convertor
- Hardware Control
- Project
- Filename
- Author
- Organisation
- Sheet
- Revision
- Date
  Date

### Library data of the parts
C9 C10 C15 C18 C19 = CAP 10nF CER 0805 50V X7R 10%-2: CAP-10nF-CER-0805-50V-X7R-10%; Manufacturer: Generic; Type: SMD; Bin: F1-C8-4; Design Item ID: CAP 10nF CER 0805 50V X7R 10%; Supplier 1: Mouser; Case/Package: 0805; Supplier Part Number 1: 81-GRM40X103K50D; Source: Capacitor Library.SchLib
C11 C12 C16 C17 C20 = CAP 1uF CER 0805 50V X7R 10%-2: CAP-1uF-CER-0805-50V-X7R-10%; Manufacturer: Generic; Type: SMD; Bin: F1-C1-05; Supplier Part Number 1: 963-UMK212B7105KG-T; Supplier 1: Mouser; Case/Package: 0805; Source: Capacitor Library.SchLib; Design Item ID: CAP 1uF CER 0805 50V X7R 10%; Status: Active
C13 C14 = CAP 100nF CER 0603 50V X7R 5%-2: CAP-100nF-CER-0603-50V-X7R-5%; Manufacturer: Generic; Type: SMD; Bin: F1-CM2-1; Supplier 1: Mouser; Case/Package: 0603; Source: Capacitor Library.SchLib; Status: Active; Supplier Part Number 1: 581-06035C104JAT2A; Design Item ID: CAP 100nF CER 0603 50V X7R 5%
R5-R14 = RES 10k 0805 125mW 1%-1: as R15 on sheet DAC Output; Design Item ID: RES 10k 0805 125mW 1%; Case/Package: 0805; Type: SMD; Status: Active; Source: Resistor Library.SchLib
SW2 = 210-8MS-2: SWITCH DIP SMD SPST 8 100mA 50V; Manufacturer: C&K Components; Supplier Part Number 1: 774-2108MS; Design Item ID: 210-8MS; Source: Switches Library.SchLib; Case/Package: 16 PDIP; Supplier 1: Mouser; Status: Active; Type: TH
SW3 = CMP-01293-3: as SW1 on sheet Power; Terminal Pitch: 2.54mm; Contact Material: Copper; Length: 0.258inch; Termination: PC Pin; Lead Free: Lead Free; Max Current Rating: 100mA; Throw Configuration: SPST; Packaging: Rail/Tube; Current Rating: 100mA; Orientation: Straight; Min Operating Temperature: -40°C; Contact Plating: Gold,Tin; Max Operating Temperature: 85°C; Package Quantity: 85; Mount: Through Hole
U3 = CMP-019-00003-1: Converters - Digital to Analog (DAC) High-End 24-Bit 192kHz, 4-Ch D-S DAC; Resolution: 24b; Number of Bits: 24; Sampling Rate: 216000S/s; Supply Type: Analog,Digital; Min Supply Voltage: 4.75V; Power Consumption: 200mW; Number of Channels: 4; Max Power Dissipation: 286mW; Operating Supply Voltage: 5V; Polarity: Bipolar; Output Type: Voltage; Nominal Supply Current: 32mA; Number of Analog Inputs: 0; Interface: Serial,SPI; Conversion Rate: 216KS/s; Max Supply Voltage: 5.25V; Signal to Noise Ratio (SNR): 118dB; REACH SVHC: No SVHC; Case/Package: TQFP; Weight: 0.004938oz; Mount: Surface Mount; Number of Converters: 4; Radiation Hardening: No; Number of Pins: 48; Contact Plating: Gold; Number of Analog Outputs: 4; Lead Free: Lead Free; Packaging: Tape and Reel; Min Operating Temperature: -10°C; Number of DAC Channels: 4; Package Quantity: 2000; Max Operating Temperature: 70°C

## Nets that join several sheets
3V3: DAC Board TOP (J1.18), Power (7 pins), DAC Channel 12 (13 pins)
AGND: DAC Board TOP (8 pins), U_DAC Output (11 pins), Power (11 pins), DAC Channel 12 (16 pins), U_DAC Output (11 pins), U_DAC Output (11 pins), U_DAC Output (11 pins)
DGND: DAC Board TOP (6 pins), Power (11 pins), DAC Channel 12 (13 pins)
V5: U_DAC Output (C23_1.1 C31_1.1 U4_1.7 U5_1.3), Power (6 pins), DAC Channel 12 (12 pins), U_DAC Output (C23_2.1 C31_2.1 U4_2.7 U5_2.3), U_DAC Output (C23_3.1 C31_3.1 U4_3.7 U5_3.3), U_DAC Output (C23_4.1 C31_4.1 U4_4.7 U5_4.3)
BCK: DAC Board TOP (J1.9 P11.7), DAC Channel 12 (U3.15)
CS': DAC Board TOP (J1.13 P12.7), DAC Channel 12 (U3.21)
DATA0: DAC Board TOP (J1.4 P11.1), DAC Channel 12 (U3.17)
DATA1: DAC Board TOP (J1.6 P11.3), DAC Channel 12 (U3.18)
LRCK: DAC Board TOP (J1.1 P11.9), DAC Channel 12 (U3.16)
MISO: DAC Board TOP (J1.11 P12.3), DAC Channel 12 (U3.24)
MOSI: DAC Board TOP (J1.12 P12.5), DAC Channel 12 (U3.23)
SCKI: DAC Board TOP (J1.7 P11.5), DAC Channel 12 (U3.14)
SPICLK: DAC Board TOP (J1.10 P12.1), DAC Channel 12 (U3.22)
SUB: DAC Board TOP (J1.3 P11.2), DAC Channel 12 (U3.13)
VIN_1_N: U_DAC Output (J9_1.1 J15_1.1 P4_1.1 P7_1.1), DAC Channel 12 (U3.2)
VIN_1_P: U_DAC Output (J12_1.1 J20_1.1 P6_1.2 P10_1.2), DAC Channel 12 (U3.1)
VIN_2_N: DAC Channel 12 (U3.46), U_DAC Output (J9_3.1 J15_3.1 P4_3.1 P7_3.1)
VIN_2_P: DAC Channel 12 (U3.47), U_DAC Output (J12_3.1 J20_3.1 P6_3.2 P10_3.2)
VIN_3_N: DAC Channel 12 (U3.39), U_DAC Output (J9_4.1 J15_4.1 P4_4.1 P7_4.1)
VIN_3_P: DAC Channel 12 (U3.38), U_DAC Output (J12_4.1 J20_4.1 P6_4.2 P10_4.2)
VIN_4_N: DAC Channel 12 (U3.35), U_DAC Output (J9_2.1 J15_2.1 P4_2.1 P7_2.1)
VIN_4_P: DAC Channel 12 (U3.36), U_DAC Output (J12_2.1 J20_2.1 P6_2.2 P10_2.2)
VOUT: DAC Board TOP (J2.2 J2.3 J2.4), U_DAC Output (J8_1.1 J10_1.2 P5_1.1)
VOUT: DAC Board TOP (J4.2 J4.3 J4.4), U_DAC Output (J8_2.1 J10_2.2 P5_2.1)
VOUT: DAC Board TOP (J13.2 J13.3 J13.4), U_DAC Output (J8_3.1 J10_3.2 P5_3.1)
VOUT: DAC Board TOP (J23.2 J23.3 J23.4), U_DAC Output (J8_4.1 J10_4.2 P5_4.1)
VOUT_1_N: DAC Board TOP (J3.4), U_DAC Output (J18_1.1 J21_1.2 P9_1.1)
VOUT_1_P: DAC Board TOP (J3.2 J3.3), U_DAC Output (J14_1.1 J17_1.2 P8_1.2)
VOUT_2_N: DAC Board TOP (J5.4), U_DAC Output (J18_2.1 J21_2.2 P9_2.1)
VOUT_2_P: DAC Board TOP (J5.2 J5.3), U_DAC Output (J14_2.1 J17_2.2 P8_2.2)
VOUT_3_N: DAC Board TOP (J22.4), U_DAC Output (J18_3.1 J21_3.2 P9_3.1)
VOUT_3_P: DAC Board TOP (J22.2 J22.3), U_DAC Output (J14_3.1 J17_3.2 P8_3.2)
VOUT_4_N: DAC Board TOP (J24.4), U_DAC Output (J18_4.1 J21_4.2 P9_4.1)
VOUT_4_P: DAC Board TOP (J24.2 J24.3), U_DAC Output (J14_4.1 J17_4.2 P8_4.2)